# Altium schematic sheet Kernal2.SchDoc
size A2
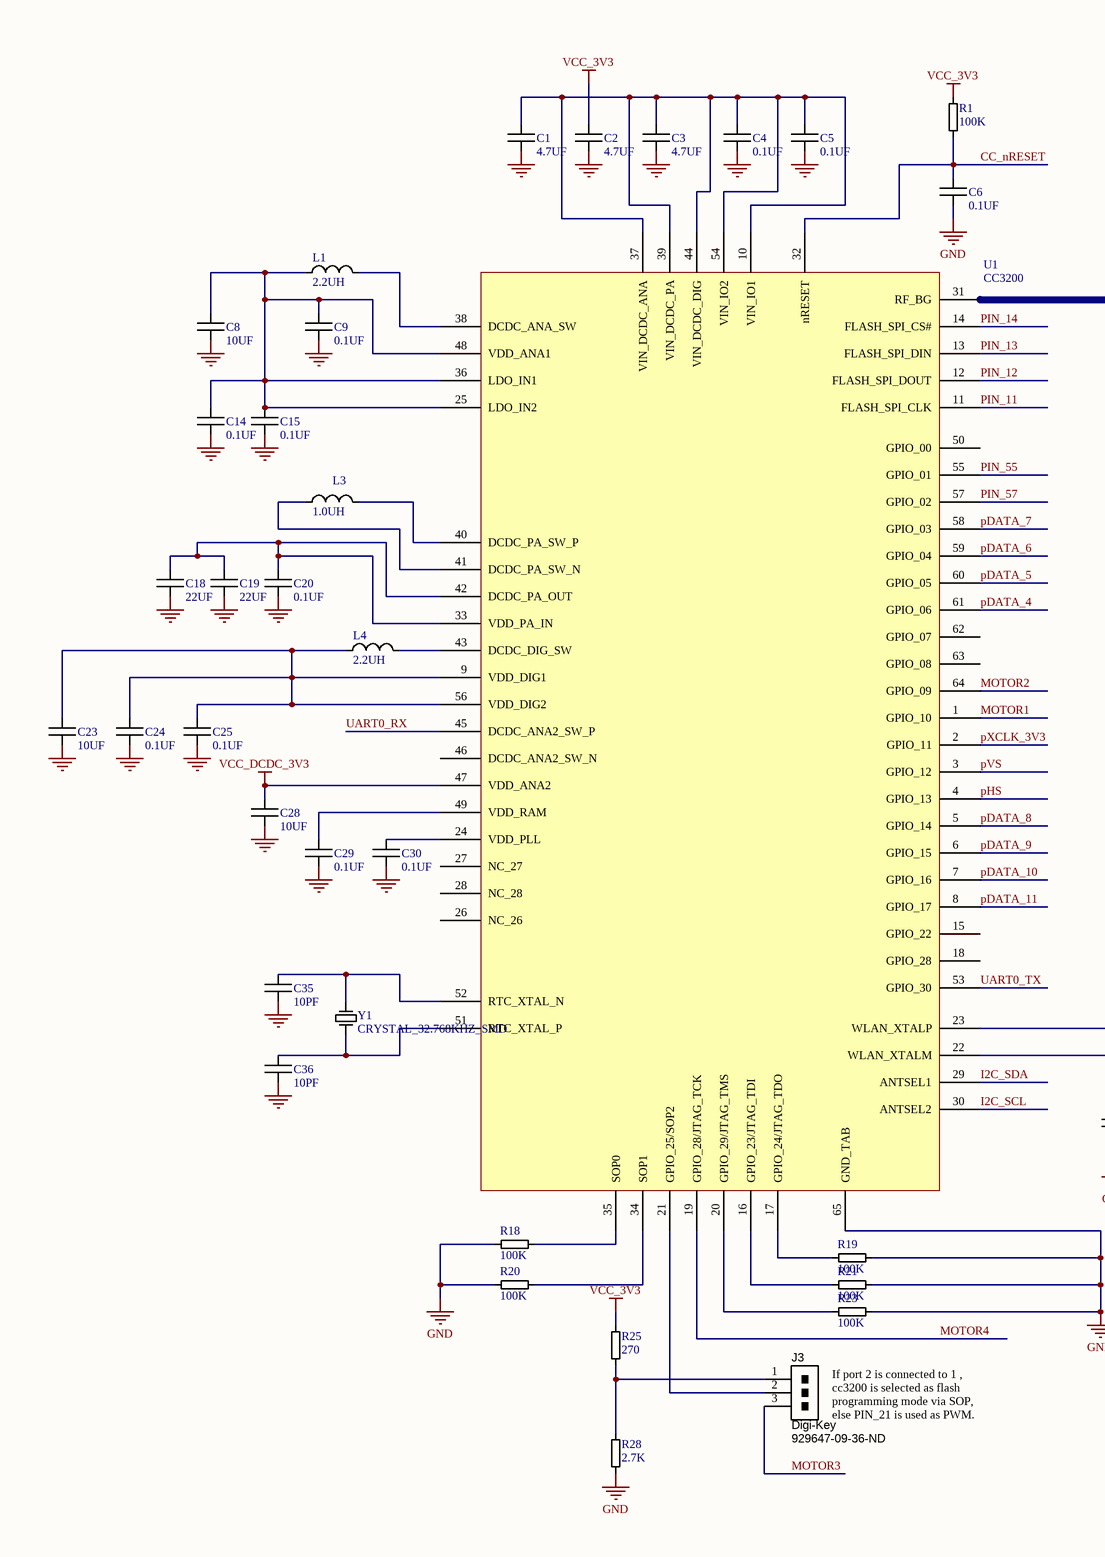
[diagram p0: Kernal2.SchDoc, left]
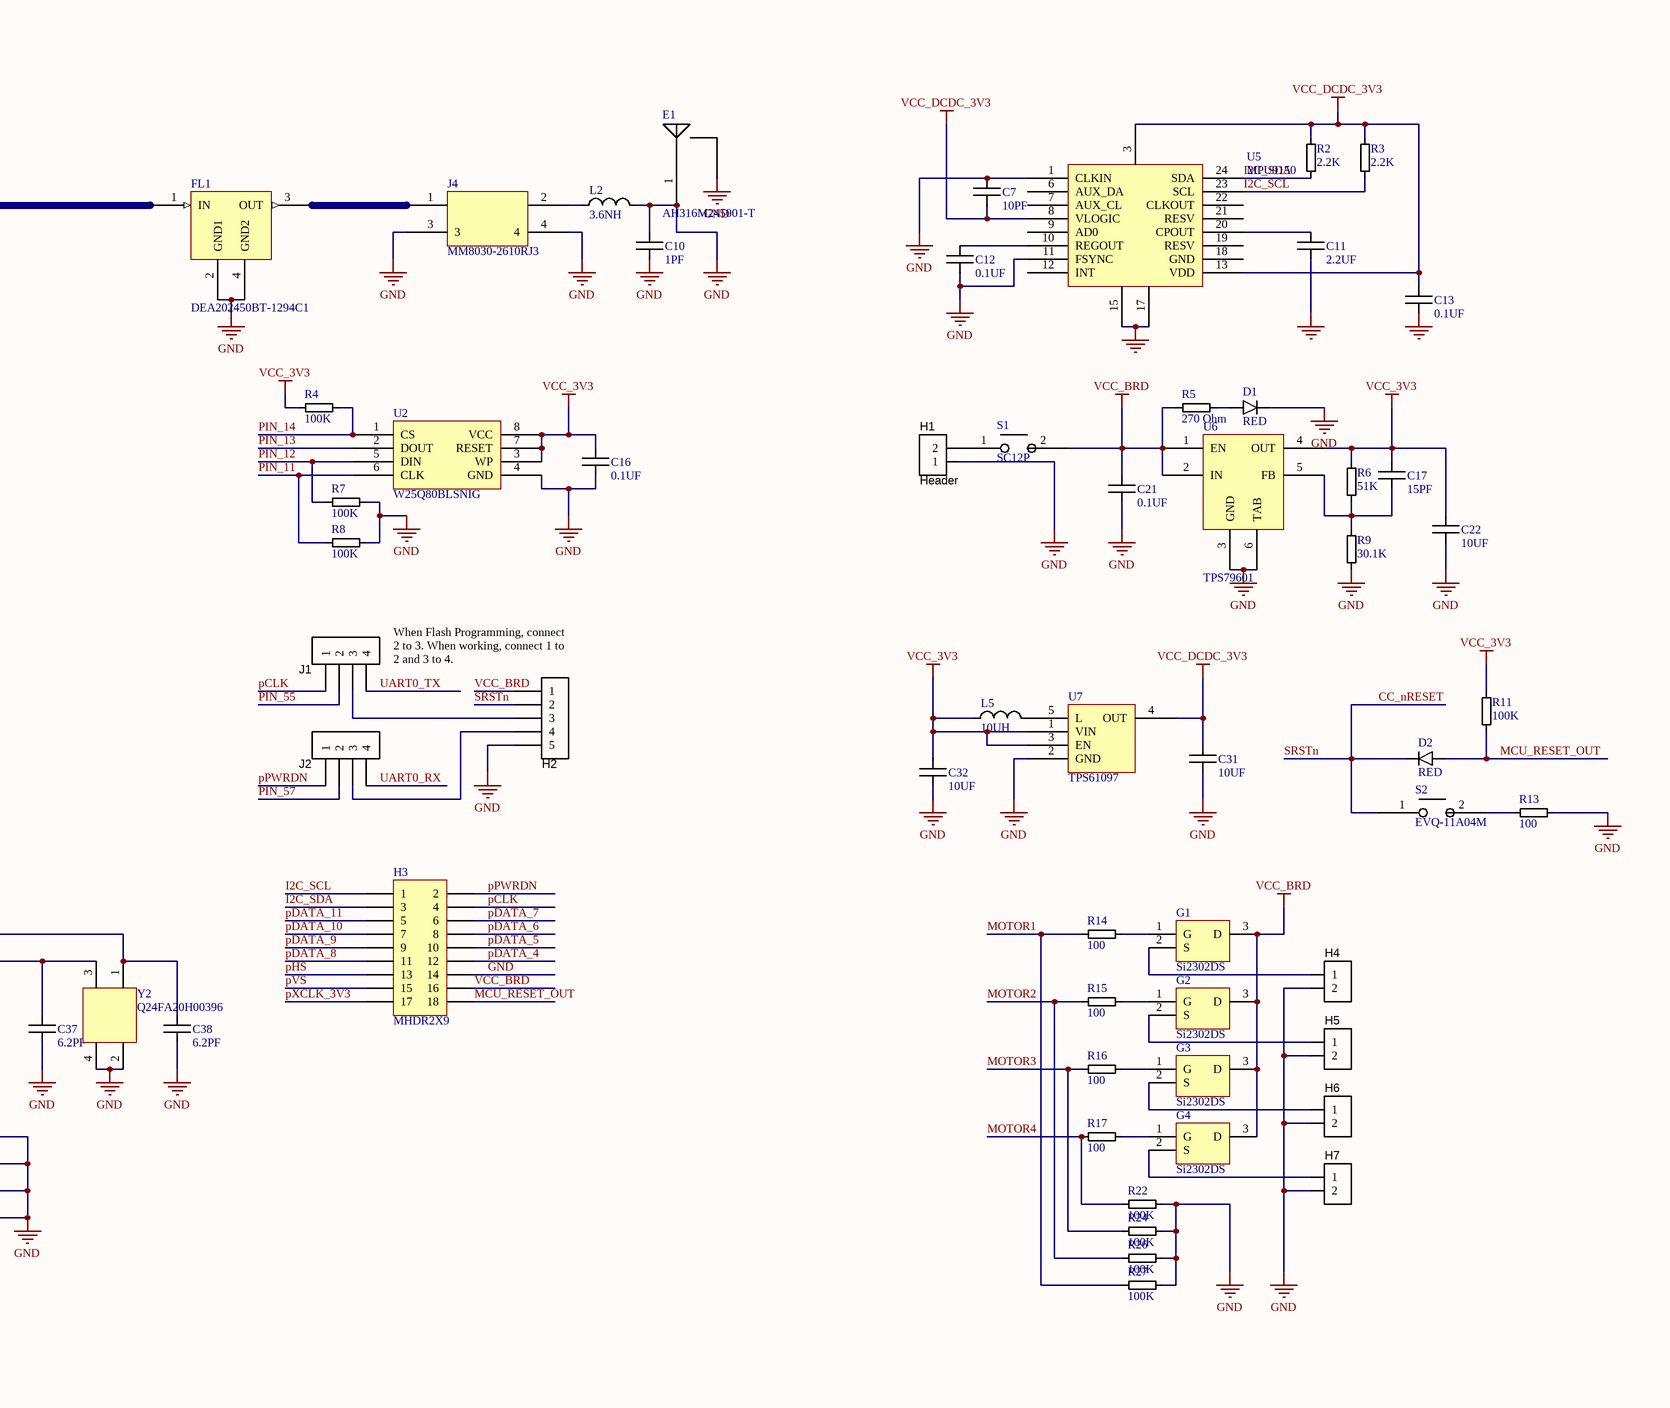
[diagram p1: Kernal2.SchDoc, right]

## Parts
C1  4.7UF  [0402]
C2  4.7UF  [0402]
C3  4.7UF  [0402]
C4  0.1UF  [0402]
C5  0.1UF  [0402]
C6  0.1UF  [0402]
C7  10PF  [0402]
C8  10UF  [0402]
C9  0.1UF  [0402]
C10  1PF  [0402]
C11  2.2UF  [0402]
C12  0.1UF  [0402]
C13  0.1UF  [0402]
C14  0.1UF  [0402]
C15  0.1UF  [0402]
C16  0.1UF  [0402]
C17  15PF  [0402]
C18  22UF  [0603]
C19  22UF  [0603]
C20  0.1UF  [0402]
C21  0.1UF  [0402]
C22  10UF  [0805]
C23  10UF  [0603]
C24  0.1UF  [0402]
C25  0.1UF  [0402]
C28  10UF  [0603]
C29  0.1UF  [0402]
C30  0.1UF  [0402]
C31  10UF  [0603]
C32  10UF  [0603]
C35  10PF  [0402]
C36  10PF  [0402]
C37  6.2PF  [0402]
C38  6.2PF  [0402]
D1  RED  [0603]
D2  RED  [0603]
E1  AH316M245001-T  [AH316M245001-T]
FL1  DEA202450BT-1294C1  [DEA202450BT-1294C1-H]
G1  Si2302DS  [Si2302DS]
G2  Si2302DS  [Si2302DS]
G3  Si2302DS  [Si2302DS]
G4  Si2302DS  [Si2302DS]
H1  Header  [MHDR1X2]  (no BOM)
H2  Programmer  [MHDR1X5]  (value not drawn)  (no BOM)
H3  MHDR2X9  [MHDR2X9]
H4  Header  [MHDR1X2]  (value not drawn)  (no BOM)
H5  Header  [MHDR1X2]  (value not drawn)  (no BOM)
H6  Header  [MHDR1X2]  (value not drawn)  (no BOM)
H7  Header  [MHDR1X2]  (value not drawn)  (no BOM)
J1  Programmer  [MHDR1X4]  (value not drawn)  (no BOM)
J2  Programmer  [MHDR1X4]  (value not drawn)  (no BOM)
J3  Supplier 1: Digi-Key  Supplier Part Number 1: 929647-09-36-ND  [MHDR1X3]  (hidden comment: CONN_HEADER_1x3P_0.100in)
J4  MM8030-2610RJ3  [MM8030-2610RJ3]
L1  2.2UH  [1008]
L2  3.6NH  [0402]
L3  1.0UH  [1007]
L4  2.2UH  [1008]
L5  10UH  [1007]
R1  100K  [0402]
R2  2.2K  [0402]
R3  2.2K  [0402]
R4  100K  [0402]
R5  270 Ohm  [0402]
R6  51K  [0402]
R7  100K  [0402]
R8  100K  [0402]
R9  30.1K  [0402]
R11  100K  [0402]
R13  100  [0402]
R14  100  [0402]
R15  100  [0402]
R16  100  [0402]
R17  100  [0402]
R18  100K  [0402]
R19  100K  [0402]
R20  100K  [0402]
R21  100K  [0402]
R22  100K  [0402]
R23  100K  [0402]
R24  100K  [0402]
R25  270  [0402]
R26  100K  [0402]
R27  100K  [0402]
R28  2.7K  [0402]
S1  SC12P  [SC12P]
S2  EVQ-11A04M  [EVQ-11]
U1  CC3200  [CC3200]
U2  W25Q80BLSNIG  [W25Q80BLSNIG]
U5  MPU9150  [MPU9150]
U6  TPS79601  [TPS79601]
U7  TPS61097  [TPS61097A-33]
Y1  CRYSTAL_32.768KHZ_SMD  [ABS07]
Y2  Q24FA20H00396

## Nets
GND: C1.1 C2.1 C3.1 C4.1 C5.1 C6.1 C7.2 C8.1 C9.1 C10.1 C10.2 C11.1 C12.1 C13.1 C14.1 C15.1 C16.1 C18.1 C19.1 C20.1 C21.1 C22.1 C23.1 C24.1 C25.1 C28.1 C29.1 C30.1 C31.1 C32.1 C35.1 C36.1 C37.1 C38.1 D1.2 E1.1(Feed) E1.2(GND) FL1.2(GND1) FL1.4(GND2) H1.1 H2.5 H3.14 H4.2 H5.2 H6.2 H7.2 J4.3 J4.4 L2.1 R7.2 R8.2 R9.1 R13.2 R18.1 R19.2 R20.1 R21.2 R22.2 R23.2 R24.2 R26.2 R27.2 R28.1 U1.65(GND_TAB) U2.4(GND) U5.1(CLKIN) U5.11(FSYNC) U5.15 U5.17 U6.3(GND) U6.6(TAB) U7.2(GND) Y2.2 Y2.4
VCC_3V3: C2.2 C16.2 C17.2 C22.2 C32.2 L5.1 R1.2 R4.1 R6.2 R11.2 R25.2 U2.3(WP) U2.7(RESET) U2.8(VCC) U6.4(OUT) U7.1(VIN) U7.3(EN)
VCC_BRD: C21.2 G1.3(D) G2.3(D) G3.3(D) G4.3(D) H2.1 H3.16 R5.1 S1.2 U6.1(EN) U6.2(IN)
VCC_DCDC_3V3: C7.1 C13.2 C28.2 C31.2 R2.2 R3.2 U1.47(VDD_ANA2) U5.3 U5.8(VLOGIC) U5.13(VDD) U7.4(OUT)
CC_nRESET: C6.2 D2.2 H2.2 R1.1 S2.1 U1.32(nRESET)  [also labelled SRSTn]
I2C_SCL: H3.1 R3.1 U1.30(ANTSEL2) U5.23(SCL)
I2C_SDA: H3.3 R2.1 U1.29(ANTSEL1) U5.24(SDA)
MCU_RESET_OUT: D2.1 H3.18 R11.1
MOTOR1: R14.1 R27.1 U1.1(GPIO_10)
MOTOR2: R15.1 R26.1 U1.64(GPIO_09)
MOTOR3: J3.3 R16.1 R24.1
MOTOR4: R17.1 R22.1 U1.19(GPIO_28/JTAG_TCK)
pCLK: H3.4 J1.1
pDATA_4: H3.12 U1.61(GPIO_06)
pDATA_5: H3.10 U1.60(GPIO_05)
pDATA_6: H3.8 U1.59(GPIO_04)
pDATA_7: H3.6 U1.58(GPIO_03)
pDATA_8: H3.11 U1.5(GPIO_14)
pDATA_9: H3.9 U1.6(GPIO_15)
pDATA_10: H3.7 U1.7(GPIO_16)
pDATA_11: H3.5 U1.8(GPIO_17)
pHS: H3.13 U1.4(GPIO_13)
PIN_11: R8.1 U1.11(FLASH_SPI_CLK) U2.6(CLK)
PIN_12: R7.1 U1.12(FLASH_SPI_DOUT) U2.5(DIN)
PIN_13: U1.13(FLASH_SPI_DIN) U2.2(DOUT)
PIN_14: R4.2 U1.14(FLASH_SPI_CS#) U2.1(CS)
PIN_55: J1.2 U1.55(GPIO_01)
PIN_57: J2.2 U1.57(GPIO_02)
pPWRDN: H3.2 J2.1
pVS: H3.15 U1.3(GPIO_12)
pXCLK_3V3: H3.17 U1.2(GPIO_11)
UART0_RX: J2.4 U1.45(DCDC_ANA2_SW_P)
UART0_TX: J1.4 U1.53(GPIO_30)
NetC1_2: C1.2 C3.2 C4.2 C5.2 U1.10(VIN_IO1) U1.37(VIN_DCDC_ANA) U1.39(VIN_DCDC_PA) U1.44(VIN_DCDC_DIG) U1.54(VIN_IO2)
NetC8_2: C8.2 C9.2 C15.2 L1.1 U1.25(LDO_IN2) U1.36(LDO_IN1) U1.48(VDD_ANA1)
NetC11_2: C11.2 U5.20(CPOUT)
NetC12_2: C12.2 U5.10(REGOUT)
NetC17_1: C17.1 R6.1 R9.2 U6.5(FB)
NetC18_2: C18.2 C19.2 C20.2 U1.33(VDD_PA_IN) U1.42(DCDC_PA_OUT)
NetC23_2: C23.2 C24.2 C25.2 L4.1 U1.9(VDD_DIG1) U1.56(VDD_DIG2)
NetC29_2: C29.2 U1.49(VDD_RAM)
NetC30_2: C30.2 U1.24(VDD_PLL)
NetC35_2: C35.2 U1.52(RTC_XTAL_N) Y1.2
NetC36_2: C36.2 U1.51(RTC_XTAL_P) Y1.1
NetC37_2: C37.2 U1.22(WLAN_XTALM) Y2.3
NetC38_2: C38.2 U1.23(WLAN_XTALP) Y2.1
NetD1_1: D1.1 R5.2
NetFL1_1: FL1.1(IN) U1.31(RF_BG)
NetFL1_3: FL1.3(OUT) J4.1
NetG1_1: G1.1(G) R14.2
NetG1_2: G1.2(S) H4.1
NetG2_1: G2.1(G) R15.2
NetG2_2: G2.2(S) H5.1
NetG3_1: G3.1(G) R16.2
NetG3_2: G3.2(S) H6.1
NetG4_1: G4.1(G) R17.2
NetG4_2: G4.2(S) H7.1
NetH1_2: H1.2 S1.1
NetH2_3: H2.3 J1.3
NetH2_4: H2.4 J2.3
NetJ3_1: J3.1 R25.1 R28.2
NetJ3_2: J3.2 U1.21(GPIO_25/SOP2)
NetJ4_2: J4.2 L2.2
NetL1_2: L1.2 U1.38(DCDC_ANA_SW)
NetL3_1: L3.1 U1.41(DCDC_PA_SW_N)
NetL3_2: L3.2 U1.40(DCDC_PA_SW_P)
NetL4_2: L4.2 U1.43(DCDC_DIG_SW)
NetL5_2: L5.2 U7.5(L)
NetR13_1: R13.1 S2.2
NetR18_2: R18.2 U1.35(SOP0)
NetR19_1: R19.1 U1.17(GPIO_24/JTAG_TDO)
NetR20_2: R20.2 U1.34(SOP1)
NetR21_1: R21.1 U1.16(GPIO_23/JTAG_TDI)
NetR23_1: R23.1 U1.20(GPIO_29/JTAG_TMS)

Not connected (* = marked no-connect by the designer): C14 2; U1 15(GPIO_22) 18(GPIO_28) 26(NC_26) 27(NC_27) 28(NC_28) 46(DCDC_ANA2_SW_N) 50(GPIO_00) 62(GPIO_07) 63(GPIO_08); U5 6(AUX_DA) 7(AUX_CL) 9(AD0) 12(INT) 18(GND) 19(RESV) 21(RESV) 22(CLKOUT)

## Notes on the sheet
- When Flash Programming, connect 2 to 3. When working, connect 1 to 2 and 3 to 4.
- If port 2 is connected to 1 , cc3200 is selected as flash programming mode via SOP, else PIN_21 is used as PWM.

## Library data of the parts
C1 = CAP_0402: CAP CER 4.7UF 6.3V 20% X5R 0402
C2 C3 = CAP_0402
C4-C6 C9 C12-C16 C20 C21 C24 C25 C29 C30 = CAP_0402: CAP CER 0.1UF 10V 10% X5R 0402
C7 = CAP_0402: CAP CER 10PF 50V NP0 0402
C8 = CAP_0402: CAP CER 10UF 6.3V 20% X5R 0603
C10 = CAP_0402: CAP CER 1PF 50V NP0 0402
C11 = CAP_0402: CAP CER 2.2UF 10V 10% X5R 0402
C17 = CAP_0402: CAP CER 15PF 50V 5% NP0 0402
C18 C19 = CAP_0603: CAP CER 22UF 4V 20% X5R 0603
C22 = CAP_0805: CAP CER 10UF 10V 10% X5R 0805
C23 C28 C31 C32 = CAP_0603: CAP CER 10UF 6.3V 20% X5R 0603
C35 C36 = CAP_0402: CAP CER 10PF 50V 1% NP0 0402
C37 C38 = CAP_0402: CAP CER 6.2PF 50V NP0 0402
D1 D2 = LED_0603: LED CHIPLED 633NM RED 0603 SMD
H1 H4-H7 = Header2P: Header, 2-pin
H2 = Header5P: Header 5-pin
H3 = MHDR2X9: Header, 9-Pin, Dual row; LatestRevisionDate: 17-Jul-2002; LatestRevisionNote: Re-released for DXP Platform.; Publisher: Altium Limited
J1 J2 = Header4P: Header 4-pin
J3 = CONN_HEADER_1x3P_0.100in: Pin Header, THT, Single-row, 2.54mm pitch; Manufacturer 1: 3M; Manufacturer Part Number 1: 929647-09-36-I; Pitch: 0.100" (2.54mm); Value: Single-row, 3 positions; QtyOverride: 0.1; SCDType: undef; Category: Connectors; Mounting Type: Through Hole; Terminal Block Type: Header, Male Pins, Single; Package / Case: Pin header; 2.54mm pitch
L1 L4 = INDUCTOR_1008: INDUCTOR 2.2UH 20% 1300MA 1008
L2 = INDUCTOR_0402: INDUCTOR 3.6NH 0.1NH 0402
L3 = INDUCTOR_1007: INDUCTOR POWER 1.0UH 1007
L5 = INDUCTOR_1007: INDUCTOR POWER 10UH 1007
R1 R4 R7 R8 R11 R18-R24 R26 R27 = RES_0402: RES 100K OHM 1/16W 5% 0402 SMD
R2 R3 = RES_0402: RES 2.2K OHM 1/10W 5% 0402 SMD
R5 = RES_0402: RES 270 OHM 1/10W 5% 0603 SMD
R6 = RES_0402: RES 51K OHM 1/16W 1% 0402
R9 = RES_0402: RES 30.1K OHM 1/16W 1% 0402 SMD
R13-R17 = RES_0402: RES 100 OHM 1/10W 5% 0402 SMD
R25 = RES_0402: RES 270 OHM 1/16W 1% 0402 SMD
R28 = RES_0402: RES 2.70K OHM 1/16W 1% 0402 SMD